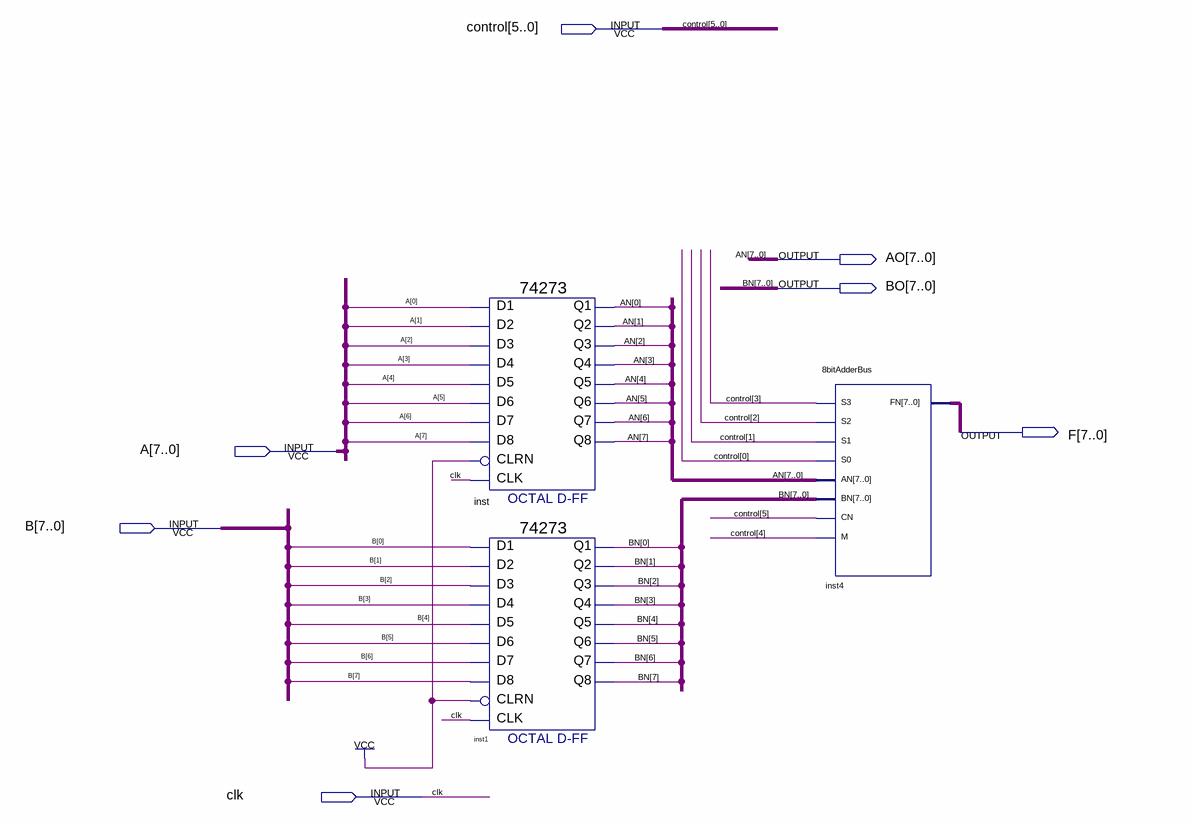
[diagram p0: schematic sheet]
// Quartus schematic alu.bdf as structural Verilog: 3 symbols, 7 pins
module alu (
  input  [5:0] control,
  input  [7:0] A,
  input  [7:0] B,
  input  clk,
  output [7:0] AO,
  output [7:0] BO,
  output [7:0] F
);

  \74273  inst (
    .D2(A[1]), .D3(A[2]), .D1(A[0]), .D4(A[3]), .D7(A[6]), .D6(A[5]), .D5(A[4]), .D8(A[7]), .CLK(clk),
    .CLRN(1'b1), .Q4(AO[3]), .Q1(AO[0]), .Q2(AO[1]), .Q3(AO[2]), .Q6(AO[5]), .Q5(AO[4]), .Q7(AO[6]),
    .Q8(AO[7]));
  \74273  inst1 (
    .D2(B[1]), .D3(B[2]), .D1(B[0]), .D4(B[3]), .D7(B[6]), .D6(B[5]), .D5(B[4]), .D8(B[7]), .CLK(clk),
    .CLRN(1'b1), .Q4(BO[3]), .Q1(BO[0]), .Q2(BO[1]), .Q3(BO[2]), .Q6(BO[5]), .Q5(BO[4]), .Q7(BO[6]),
    .Q8(BO[7]));
  \8bitAdderBus  inst4 (
    .S3(control[3]), .S2(control[2]), .S1(control[1]), .S0(control[0]), .AN(AO), .BN(BO), .CN(control[5]),
    .M(control[4]), .FN(F));

  // Other names for the same wires on the sheet: AN[7:0] = AO; BN[7:0] = BO
endmodule
